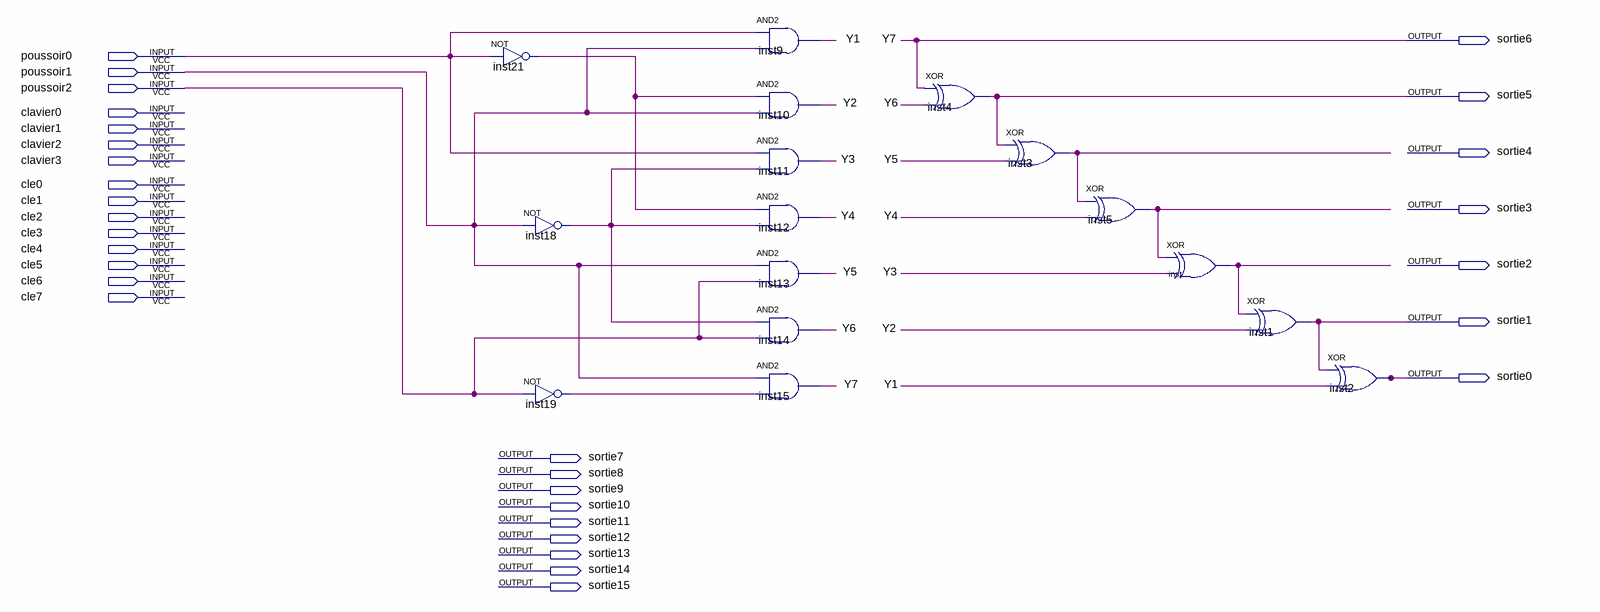
[diagram p0: schematic sheet]
// Quartus schematic fpga1.bdf as structural Verilog: 16 symbols, 31 pins
module fpga1 (
  input  poussoir0,
  input  poussoir1,
  input  poussoir2,
  input  clavier0,
  input  clavier1,
  input  clavier2,
  input  clavier3,
  input  cle0,
  input  cle1,
  input  cle2,
  input  cle3,
  input  cle4,
  input  cle5,
  input  cle6,
  input  cle7,
  output sortie6,
  output sortie5,
  output sortie4,
  output sortie3,
  output sortie2,
  output sortie1,
  output sortie0,
  output sortie7,
  output sortie8,
  output sortie9,
  output sortie10,
  output sortie11,
  output sortie12,
  output sortie13,
  output sortie14,
  output sortie15
);

  wire inst3_out, inst5_out, inst18_out, inst19_out, inst21_out, inst_out, Y1, Y2, Y3, Y4, Y5, Y6;

  not inst21 (inst21_out, poussoir0);
  not inst18 (inst18_out, poussoir1);
  not inst19 (inst19_out, poussoir2);
  and inst9 (Y1, poussoir0, poussoir1);
  and inst10 (Y2, inst21_out, poussoir1);
  and inst11 (Y3, poussoir0, inst18_out);
  and inst12 (Y4, inst21_out, inst18_out);
  and inst13 (Y5, poussoir1, poussoir2);
  and inst14 (Y6, inst18_out, poussoir2);
  and inst15 (sortie6, poussoir1, inst19_out);
  xor inst4 (sortie5, sortie6, Y6);
  xor inst3 (inst3_out, sortie5, Y5);
  xor inst5 (inst5_out, inst3_out, Y4);
  xor inst (inst_out, inst5_out, Y3);
  xor inst1 (sortie1, inst_out, Y2);
  xor inst2 (sortie0, sortie1, Y1);

  // Other names for the same wires on the sheet: Y7 = sortie6
endmodule
